# EAGLE design eCog105_Joystick_PS2 (EAGLE 6.6.0)
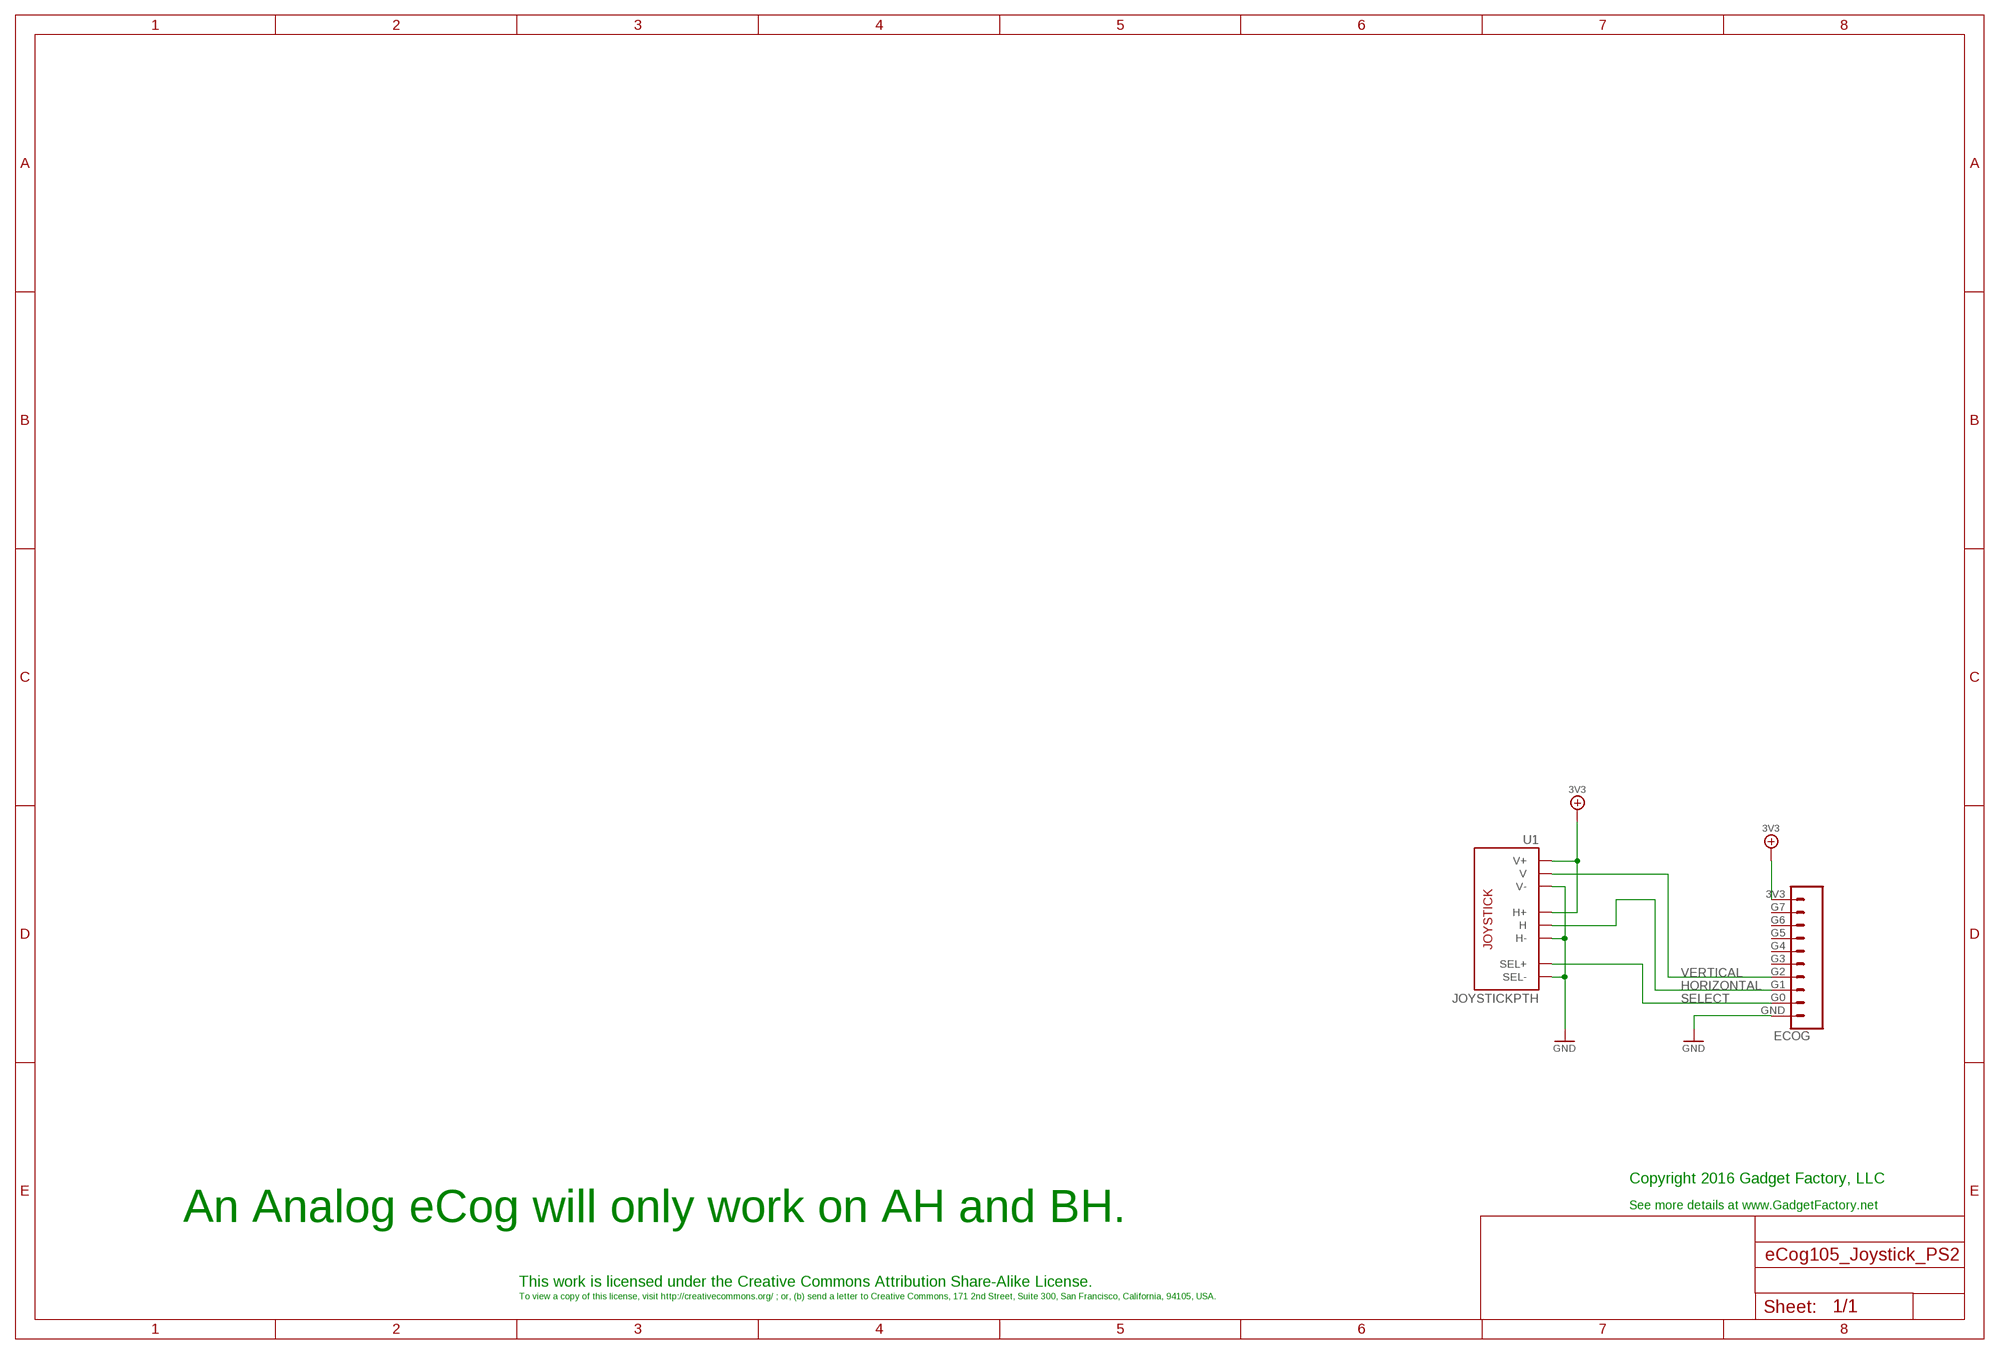
[diagram p0: schematic, sheet 1]

## Parts
ECOG  ECOG_GENERAL_ROWECOG_GENERAL_SMD  [ECOG_GENERAL_SMD]
U1  JOYSTICKPTH  [JOYSTICK]

## Nets
3V3: ECOG.3V3 U1.H1(H+) U1.V1(V+)
GND: ECOG.GND U1.B2A(SEL-) U1.H3(H-) U1.V3(V-)
HORIZONTAL: ECOG.G1 U1.H2(H)
SELECT: ECOG.G0 U1.B1A(SEL+)
VERTICAL: ECOG.G2 U1.V2(V)
Unconnected: ECOG.G3 ECOG.G4 ECOG.G5 ECOG.G6 ECOG.G7

## Notes on the sheet
- Copyright 2016 Gadget Factory, LLC
- See more details at www.GadgetFactory.net
- An Analog eCog will only work on AH and BH.
- This work is licensed under the Creative Commons Attribution Share-Alike License.
- To view a copy of this license, visit http://creativecommons.org/ ; or, (b) send a letter to Creative Commons, 171 2nd Street, Suite 300, San Francisco, California, 94105, USA.

## Library data of the parts
ECOG = eCogs:ECOG_GENERAL_ROW; DIGIKEY: S1013EC-10-ND
U1 = adafruit:JOYSTICK: Thumb Joystick Joystick commonly found in PS2 controllers. Two pots and a select switch. Adapted from Sparkfun Library (but for more common 6mm switch sticks); SPARKFUN: COM-09032

## Board
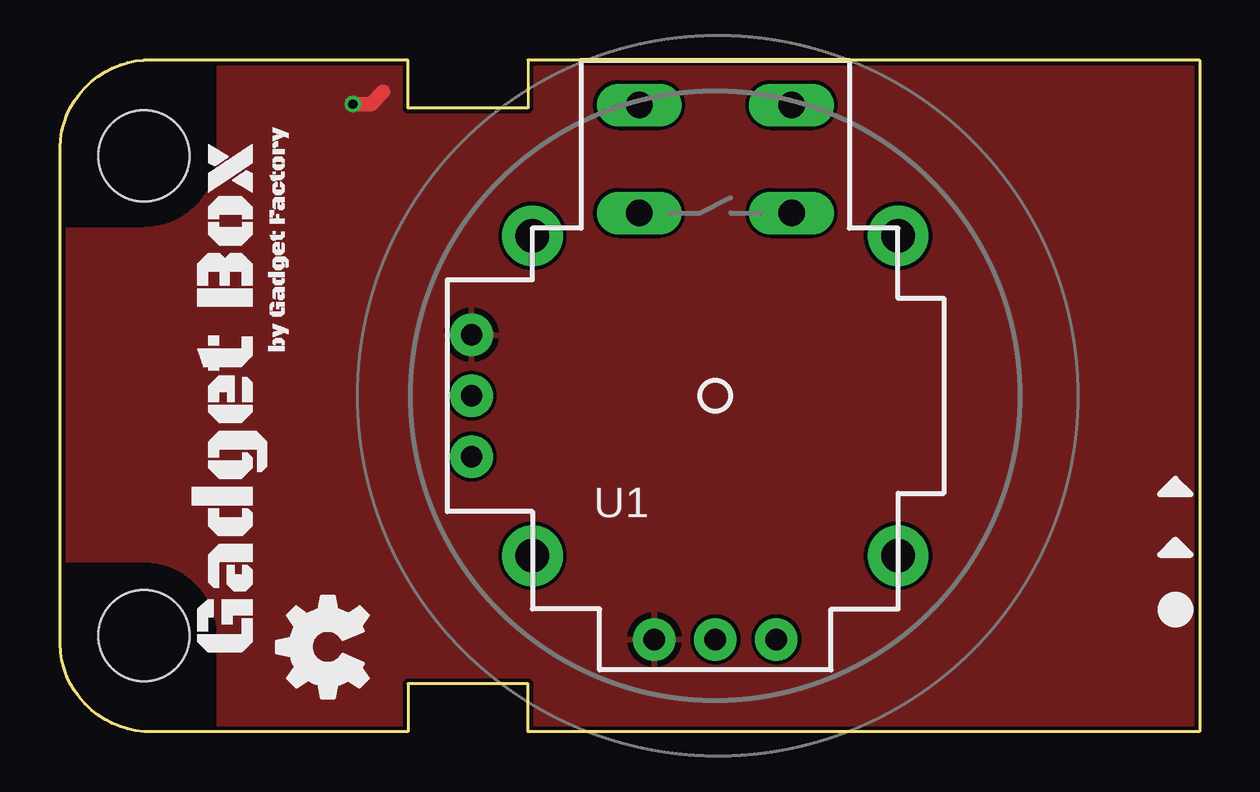
[diagram p1: board, top side]
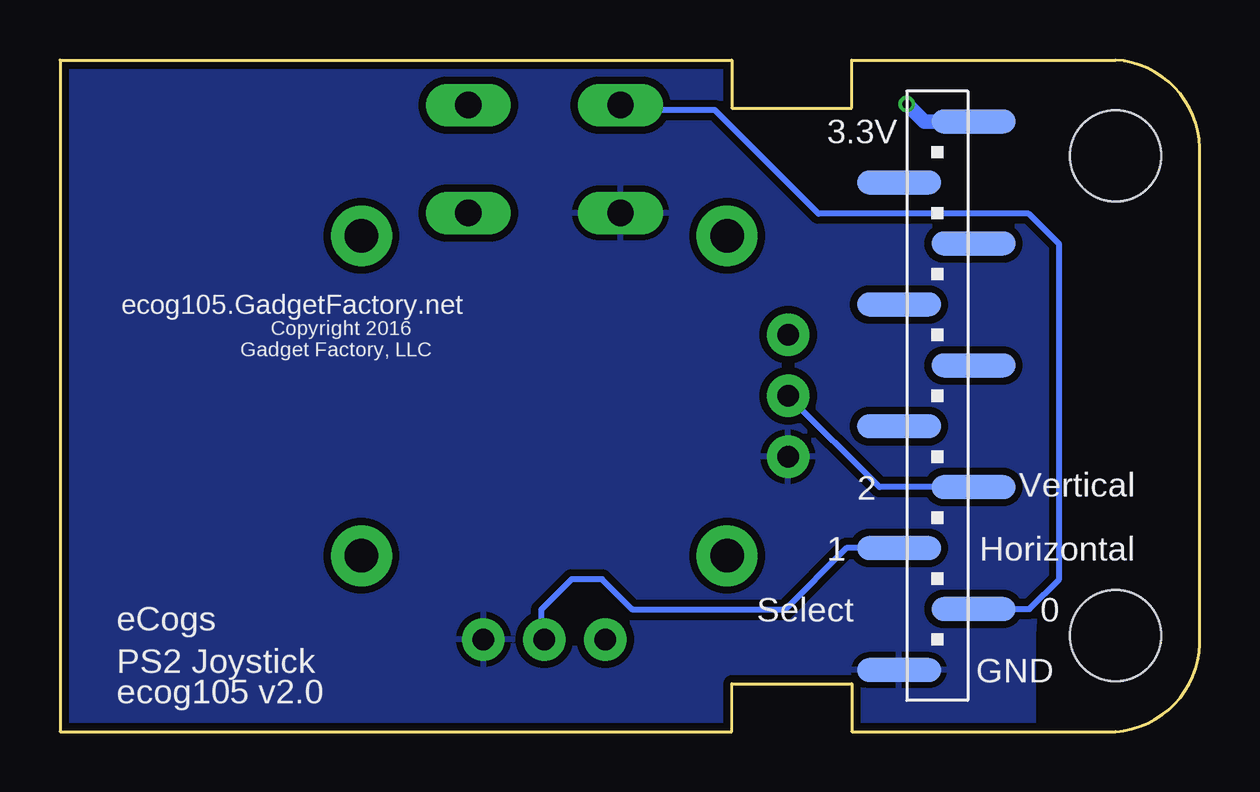
[diagram p2: board, bottom side, seen from below]

Size 47.51 x 28 mm. Coordinates in mm from the lower left corner, seen from the top.
Copper layers (1*16): Top 0.035mm / dielectric 1.5mm / Bottom 0.035mm
Design rules "hackvana *": minimum track width 6mil, minimum drill 0.3mm, track to track 6mil, track to pad 6mil, pad to pad 6mil, via to via 6mil, smd to smd 0mil, copper to edge 6mil, drill to drill 6mil, minimum pad ring 10mil, minimum via ring 6mil, stop-mask expansion 2mil, vias tented up to drill 100mil, thermal gap 10mil

### Footprints (pad centres in the part's own frame; a part is rotated, then mirrored left to right if it is on the bottom)
ECOG_GENERAL_SMD = smd 3.5 x 1 bottom: 3V3 9.923,25.429; G0 9.923,5.111; G1 13.022,7.649; G2 9.923,10.189; G3 13.022,12.729; G4 9.923,15.269; G5 13.022,17.809; G6 9.923,20.349; G7 13.022,22.889; GND 13.022,2.571 | hole 3.8: 4,24; 4,4
JOYSTICK = drill 1.1 pad 1.778 long: B1A -3.175,12.12; B1B 3.175,12.12; B2A -3.175,7.62; B2B 3.175,7.62 | drill 0.889 pad 1.778: H1 -2.54,-10.16; H2 0,-10.16; H3 2.54,-10.16; V1 -10.16,2.54; V2 -10.16,0; V3 -10.16,-2.54 | drill 1.397 pad 2.54: MOUNT1 -7.62,6.668; MOUNT2 -7.62,-6.668; MOUNT3 7.62,-6.668; MOUNT4 7.62,6.668

### Placement (x,y rotation side)
ECOG  -0.49,0 0 top
U1  27.32,14 0 top
U$1  [LEGEND_ANALOG]  46.5,10.16 0 top
U$2  [LEGEND_ANALOG]  46.5,7.62 0 top
U$3  [LEGEND_DIO]  46.5,5.08 0 top
U$4  [GADGETBOX_SMALL]  7.13,13.97 90 top
U$5  [OSHW_FILLX150_NOTEXT]  12.84,1.4 90 top

### Tracks (layer width: path | path; a pad name or v marks a point on that pad's centre or on a via)
3V3  (via drill 0.38)
  Top 0.61: v12.21,26.16 12.97,26.16 13.48,26.67
  Bottom 0.61: ECOG.3V3 11.47,25.43 v12.21,26.16
  pour Top: -1.76,29.27 48.78,29.27 48.78,-1.27 -1.76,-1.27
GND
  pour Bottom (isolate 0.305): -3.03,30.54 50.05,30.54 50.05,-2.54 -3.03,-2.54
HORIZONTAL
  Bottom 0.254: ECOG.G1 14.72,7.65 17.29,5.08 23.64,5.08 24.91,6.35 26.18,6.35 27.45,5.08 27.45,3.97 U1.H2
SELECT
  Bottom 0.254: ECOG.G0 7.1,5.11 5.86,6.35 5.86,20.32 7.13,21.59 15.89,21.59 20.21,25.91 23.93,25.91 U1.B1A
VERTICAL
  Bottom 0.254: ECOG.G2 13.35,10.19 U1.V2

### Text on the board
bPlace: 3.3V | Copyright 2016 | ecog105.GadgetFactory.net | Gadget Factory, LLC | Vertical | 2 | Horizontal | 1 | 0 | Select | eCogs | GND | PS2 Joystick | ecog105 v2.0